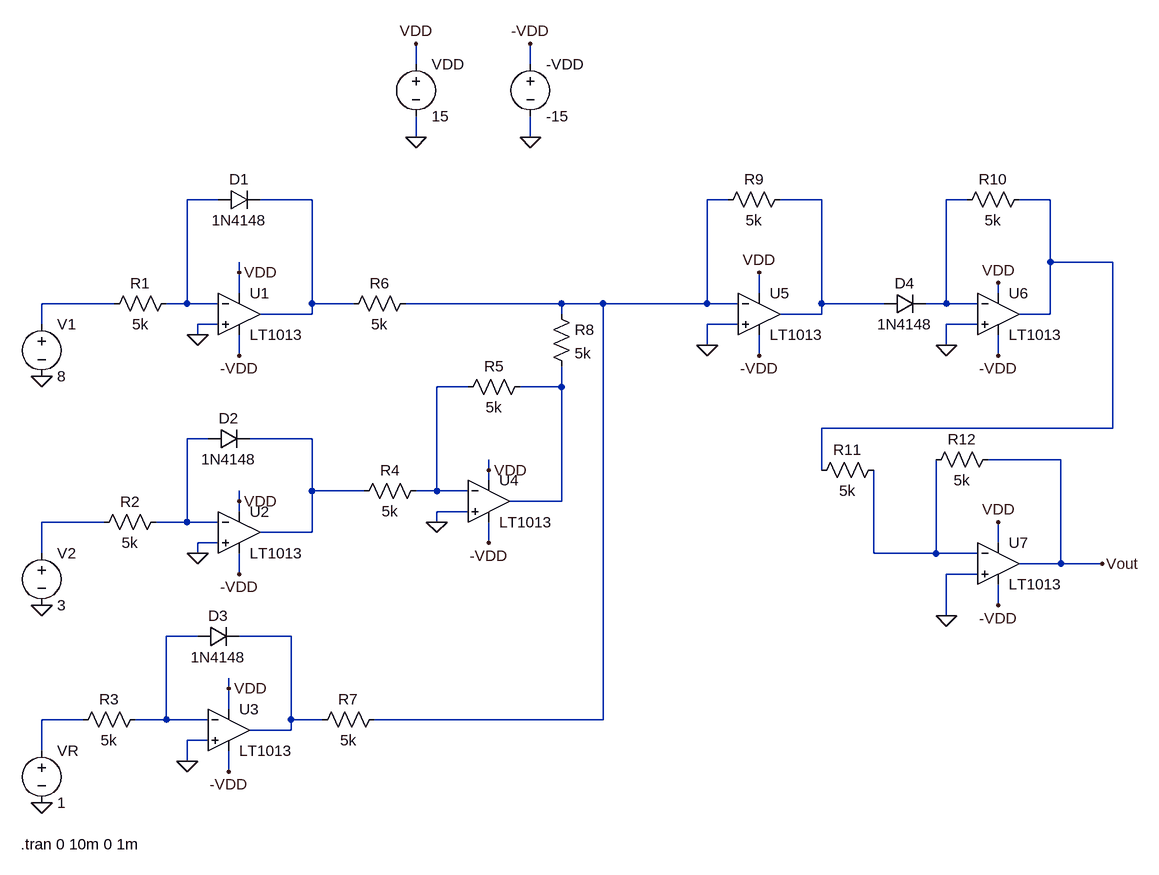
[diagram p0: schematic Divider_Circuit.asc]
Divider_Circuit.asc, the LTspice schematic file:
Version 4.1
SHEET 1 904 896
WIRE -224 -320 -224 -352
WIRE -48 -320 -48 -352
WIRE -224 -208 -224 -240
WIRE -48 -208 -48 -240
WIRE -528 -112 -576 -112
WIRE -384 -112 -464 -112
WIRE 256 -112 224 -112
WIRE 400 -112 336 -112
WIRE 624 -112 592 -112
WIRE 752 -112 704 -112
WIRE 752 -16 752 -112
WIRE 848 -16 752 -16
WIRE -496 0 -496 -16
WIRE -496 32 -496 0
WIRE 304 32 304 0
WIRE 672 32 672 16
WIRE -688 48 -800 48
WIRE -576 48 -576 -112
WIRE -576 48 -608 48
WIRE -528 48 -576 48
WIRE -384 48 -384 -112
WIRE -320 48 -384 48
WIRE 0 48 -240 48
WIRE 64 48 0 48
WIRE 224 48 224 -112
WIRE 224 48 64 48
WIRE 272 48 224 48
WIRE 400 48 400 -112
WIRE 496 48 400 48
WIRE 592 48 592 -112
WIRE 592 48 560 48
WIRE 640 48 592 48
WIRE -384 64 -384 48
WIRE -384 64 -464 64
WIRE 0 64 0 48
WIRE 400 64 400 48
WIRE 400 64 336 64
WIRE 752 64 752 -16
WIRE 752 64 704 64
WIRE -800 80 -800 48
WIRE -528 80 -560 80
WIRE 272 80 224 80
WIRE 640 80 592 80
WIRE -560 96 -560 80
WIRE 224 112 224 80
WIRE 592 112 592 80
WIRE -496 128 -496 96
WIRE 304 128 304 96
WIRE 672 128 672 96
WIRE -144 176 -192 176
WIRE 0 176 0 144
WIRE 0 176 -64 176
WIRE 848 240 848 -16
WIRE 848 240 400 240
WIRE -544 256 -576 256
WIRE -384 256 -480 256
WIRE 768 288 656 288
WIRE -112 304 -112 288
WIRE 400 304 400 240
WIRE -112 320 -112 304
WIRE -384 336 -384 256
WIRE -304 336 -384 336
WIRE -192 336 -192 176
WIRE -192 336 -224 336
WIRE -144 336 -192 336
WIRE -496 352 -496 336
WIRE 0 352 0 176
WIRE 0 352 -80 352
WIRE -496 368 -496 352
WIRE -144 368 -192 368
WIRE -704 384 -800 384
WIRE -576 384 -576 256
WIRE -576 384 -624 384
WIRE -528 384 -576 384
WIRE -192 384 -192 368
WIRE -384 400 -384 336
WIRE -384 400 -464 400
WIRE -528 416 -560 416
WIRE -112 416 -112 384
WIRE 672 416 672 384
WIRE -800 432 -800 384
WIRE -560 432 -560 416
WIRE 480 432 480 304
WIRE 576 432 576 288
WIRE 576 432 480 432
WIRE 640 432 576 432
WIRE 768 448 768 288
WIRE 768 448 704 448
WIRE 832 448 768 448
WIRE -496 464 -496 432
WIRE 640 464 592 464
WIRE 672 512 672 480
WIRE 592 528 592 464
WIRE -560 560 -608 560
WIRE -416 560 -496 560
WIRE -512 640 -512 624
WIRE -512 672 -512 640
WIRE -736 688 -800 688
WIRE -608 688 -608 560
WIRE -608 688 -656 688
WIRE -544 688 -608 688
WIRE -416 688 -416 560
WIRE -368 688 -416 688
WIRE 64 688 64 48
WIRE 64 688 -288 688
WIRE -416 704 -416 688
WIRE -416 704 -480 704
WIRE -544 720 -576 720
WIRE -800 736 -800 688
WIRE -576 752 -576 720
WIRE -512 768 -512 736
FLAG -224 -208 0
FLAG -48 -208 0
FLAG -224 -352 VDD
FLAG -48 -352 -VDD
FLAG -800 160 0
FLAG -800 512 0
FLAG -800 816 0
FLAG -560 432 0
FLAG -560 96 0
FLAG -576 752 0
FLAG -496 0 VDD
FLAG -496 128 -VDD
FLAG -496 352 VDD
FLAG -496 464 -VDD
FLAG -512 640 VDD
FLAG -512 768 -VDD
FLAG -192 384 0
FLAG -112 304 VDD
FLAG -112 416 -VDD
FLAG 304 0 VDD
FLAG 304 128 -VDD
FLAG 224 112 0
FLAG 672 16 VDD
FLAG 672 128 -VDD
FLAG 592 112 0
FLAG 672 384 VDD
FLAG 672 512 -VDD
FLAG 592 528 0
FLAG 832 448 Vout
SYMBOL voltage -224 -336 R0
SYMATTR InstName VDD
SYMATTR Value 15
SYMBOL voltage -48 -336 R0
SYMATTR InstName -VDD
SYMATTR Value -15
SYMBOL voltage -800 64 R0
WINDOW 123 0 0 Left 0
WINDOW 39 0 0 Left 0
SYMATTR InstName V1
SYMATTR Value 8
SYMBOL voltage -800 416 R0
WINDOW 123 0 0 Left 0
WINDOW 39 0 0 Left 0
SYMATTR InstName V2
SYMATTR Value 3
SYMBOL voltage -800 720 R0
SYMATTR InstName VR
SYMATTR Value 1
SYMBOL res -592 32 R90
WINDOW 0 0 56 VBottom 2
WINDOW 3 32 56 VTop 2
SYMATTR InstName R1
SYMATTR Value 5k
SYMBOL res -608 368 R90
WINDOW 0 0 56 VBottom 2
WINDOW 3 32 56 VTop 2
SYMATTR InstName R2
SYMATTR Value 5k
SYMBOL res -640 672 R90
WINDOW 0 0 56 VBottom 2
WINDOW 3 32 56 VTop 2
SYMATTR InstName R3
SYMATTR Value 5k
SYMBOL OpAmps\\LT1013 -496 0 R0
SYMATTR InstName U1
SYMBOL OpAmps\\LT1013 -496 336 R0
SYMATTR InstName U2
SYMBOL OpAmps\\LT1013 -512 640 R0
SYMATTR InstName U3
SYMBOL diode -528 -96 R270
WINDOW 0 32 32 VTop 2
WINDOW 3 0 32 VBottom 2
SYMATTR InstName D1
SYMATTR Value 1N4148
SYMBOL diode -544 272 R270
WINDOW 0 32 32 VTop 2
WINDOW 3 0 32 VBottom 2
SYMATTR InstName D2
SYMATTR Value 1N4148
SYMBOL diode -560 576 R270
WINDOW 0 32 32 VTop 2
WINDOW 3 0 32 VBottom 2
SYMATTR InstName D3
SYMATTR Value 1N4148
SYMBOL res -208 320 R90
WINDOW 0 0 56 VBottom 2
WINDOW 3 32 56 VTop 2
SYMATTR InstName R4
SYMATTR Value 5k
SYMBOL OpAmps\\LT1013 -112 288 R0
SYMATTR InstName U4
SYMBOL res -160 192 R270
WINDOW 0 32 56 VTop 2
WINDOW 3 0 56 VBottom 2
SYMATTR InstName R5
SYMATTR Value 5k
SYMBOL res -224 32 R90
WINDOW 0 0 56 VBottom 2
WINDOW 3 32 56 VTop 2
SYMATTR InstName R6
SYMATTR Value 5k
SYMBOL res -272 672 R90
WINDOW 0 0 56 VBottom 2
WINDOW 3 32 56 VTop 2
SYMATTR InstName R7
SYMATTR Value 5k
SYMBOL res -16 48 R0
SYMATTR InstName R8
SYMATTR Value 5k
SYMBOL OpAmps\\LT1013 304 0 R0
SYMATTR InstName U5
SYMBOL res 352 -128 R90
WINDOW 0 0 56 VBottom 2
WINDOW 3 32 56 VTop 2
SYMATTR InstName R9
SYMATTR Value 5k
SYMBOL diode 496 64 R270
WINDOW 0 32 32 VTop 2
WINDOW 3 0 32 VBottom 2
SYMATTR InstName D4
SYMATTR Value 1N4148
SYMBOL OpAmps\\LT1013 672 0 R0
SYMATTR InstName U6
SYMBOL res 720 -128 R90
WINDOW 0 0 56 VBottom 2
WINDOW 3 32 56 VTop 2
SYMATTR InstName R10
SYMATTR Value 5k
SYMBOL res 496 288 R90
WINDOW 0 0 56 VBottom 2
WINDOW 3 32 56 VTop 2
SYMATTR InstName R11
SYMATTR Value 5k
SYMBOL OpAmps\\LT1013 672 384 R0
SYMATTR InstName U7
SYMBOL res 672 272 R90
WINDOW 0 0 56 VBottom 2
WINDOW 3 32 56 VTop 2
SYMATTR InstName R12
SYMATTR Value 5k
TEXT -832 880 Left 2 !.tran 0 10m 0 1m

The netlist it stands for:
* Divider_Circuit.asc
VDD VDD 0 15
V§-VDD -VDD 0 -15
V1 N007 0 8
V2 N012 0 3
VR N016 0 1
R1 N001 N007 5k
R2 N010 N012 5k
R3 N014 N016 5k
X§U1 0 N001 VDD -VDD N002 LT1013  ; pins In+ In- V+ V- OUT
X§U2 0 N010 VDD -VDD N011 LT1013  ; pins In+ In- V+ V- OUT
X§U3 0 N014 VDD -VDD N015 LT1013  ; pins In+ In- V+ V- OUT
D1 N001 N002 1N4148
D2 N010 N011 1N4148
D3 N014 N015 1N4148
R4 N008 N011 5k
X§U4 0 N008 VDD -VDD N009 LT1013  ; pins In+ In- V+ V- OUT
R5 N008 N009 5k
R6 N003 N002 5k
R7 N003 N015 5k
R8 N003 N009 5k
X§U5 0 N003 VDD -VDD N004 LT1013  ; pins In+ In- V+ V- OUT
R9 N004 N003 5k
D4 N004 N005 1N4148
X§U6 0 N005 VDD -VDD N006 LT1013  ; pins In+ In- V+ V- OUT
R10 N006 N005 5k
R11 N013 N006 5k
X§U7 0 N013 VDD -VDD Vout LT1013  ; pins In+ In- V+ V- OUT
R12 Vout N013 5k
.model D D
.lib standard.dio
.tran 0 10m 0 1m
.lib LTC.lib
.backanno
.end